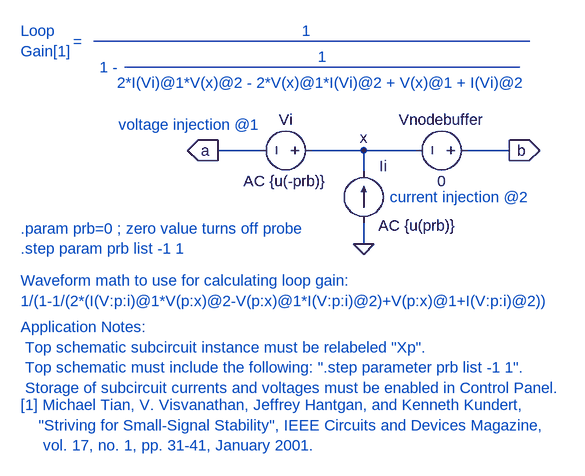
[diagram p0: schematic LoopGainProbe.asc]
LoopGainProbe.asc, the LTspice schematic file:
Version 4
SHEET 1 928 680
WIRE -48 112 16 112
WIRE 96 112 176 112
WIRE 176 144 176 112
WIRE 176 112 256 112
WIRE 176 256 176 224
WIRE 336 112 400 112
FLAG 176 256 0
FLAG -48 112 a
IOPIN -48 112 Out
FLAG 400 112 b
IOPIN 400 112 Out
FLAG 176 112 x
SYMBOL current 176 224 M180
WINDOW 0 24 88 Left 0
WINDOW 3 24 0 Left 0
WINDOW 123 23 -4 Left 0
WINDOW 39 0 0 Left 0
SYMATTR InstName Ii
SYMATTR Value ""
SYMATTR Value2 AC {u(prb)}
SYMBOL voltage 112 112 M270
WINDOW 0 32 56 VTop 0
WINDOW 3 -32 56 VBottom 0
WINDOW 123 -32 56 VBottom 0
WINDOW 39 -32 56 VBottom 0
SYMATTR InstName Vi
SYMATTR Value ""
SYMATTR Value2 AC {u(-prb)}
SYMBOL voltage 352 112 R90
WINDOW 0 -32 56 VBottom 0
WINDOW 3 32 56 VTop 0
SYMATTR InstName Vnodebuffer
SYMATTR Value 0
TEXT -352 232 Left 0 ;.param prb=0 ; zero value turns off probe\n.step param prb list -1 1
TEXT 88 -72 Center 0 ;1
TEXT 112 -32 Center 0 ;1
TEXT 112 8 Center 0 ;2*I(Vi)@1*V(x)@2 - 2*V(x)@1*I(Vi)@2 + V(x)@1 + I(Vi)@2
TEXT -216 -16 Center 0 ;1 -
TEXT -352 504 Left 0 ;[1] Michael Tian, V. Visvanathan, Jeffrey Hantgan, and Kenneth Kundert,\n    "Striving for Small-Signal Stability", IEEE Circuits and Devices Magazine,\n     vol. 17, no. 1, pp. 31-41, January 2001.
TEXT -352 344 Left 0 ;1/(1-1/(2*(I(V:p:i)@1*V(p:x)@2-V(p:x)@1*I(V:p:i)@2)+V(p:x)@1+I(V:p:i)@2))
TEXT -352 384 Left 0 ;Application Notes: \n Top schematic subcircuit instance must be relabeled "Xp".\n Top schematic must include the following: ".step parameter prb list -1 1".\n Storage of subcircuit currents and voltages must be enabled in Control Panel.
TEXT -352 312 Left 0 ;Waveform math to use for calculating loop gain:
TEXT -352 -72 Left 0 ;Loop\nGain[1]
TEXT -264 -56 Center 0 ;=
TEXT 216 184 Left 0 ;current injection @2
TEXT 16 72 Right 0 ;voltage injection @1
LINE Normal 432 -56 -240 -56
LINE Normal 416 -16 -192 -16

The netlist it stands for:
* LoopGainProbe.asc
Ii 0 x AC {u(prb)}
Vi x a AC {u(-prb)}
Vnodebuffer b x 0
* .param prb=0 ; zero value turns off probe
* .step param prb list -1 1
* 1
* 1
* 2*I(Vi)@1*V(x)@2 - 2*V(x)@1*I(Vi)@2 + V(x)@1 + I(Vi)@2
* 1 -
* [1] Michael Tian, V. Visvanathan, Jeffrey Hantgan, and Kenneth Kundert,
*     "Striving for Small-Signal Stability", IEEE Circuits and Devices Magazine,
*      vol. 17, no. 1, pp. 31-41, January 2001.
* 1/(1-1/(2*(I(V:p:i)@1*V(p:x)@2-V(p:x)@1*I(V:p:i)@2)+V(p:x)@1+I(V:p:i)@2))
* Application Notes:
*  Top schematic subcircuit instance must be relabeled "Xp".
*  Top schematic must include the following: ".step parameter prb list -1 1".
*  Storage of subcircuit currents and voltages must be enabled in Control Panel.
* Waveform math to use for calculating loop gain:
* Loop
* Gain[1]
* =
* current injection @2
* voltage injection @1
.backanno
.end